# Altium schematic sheet Connectors.SchDoc
size A; SheetNumber: 2; SheetTotal: 2
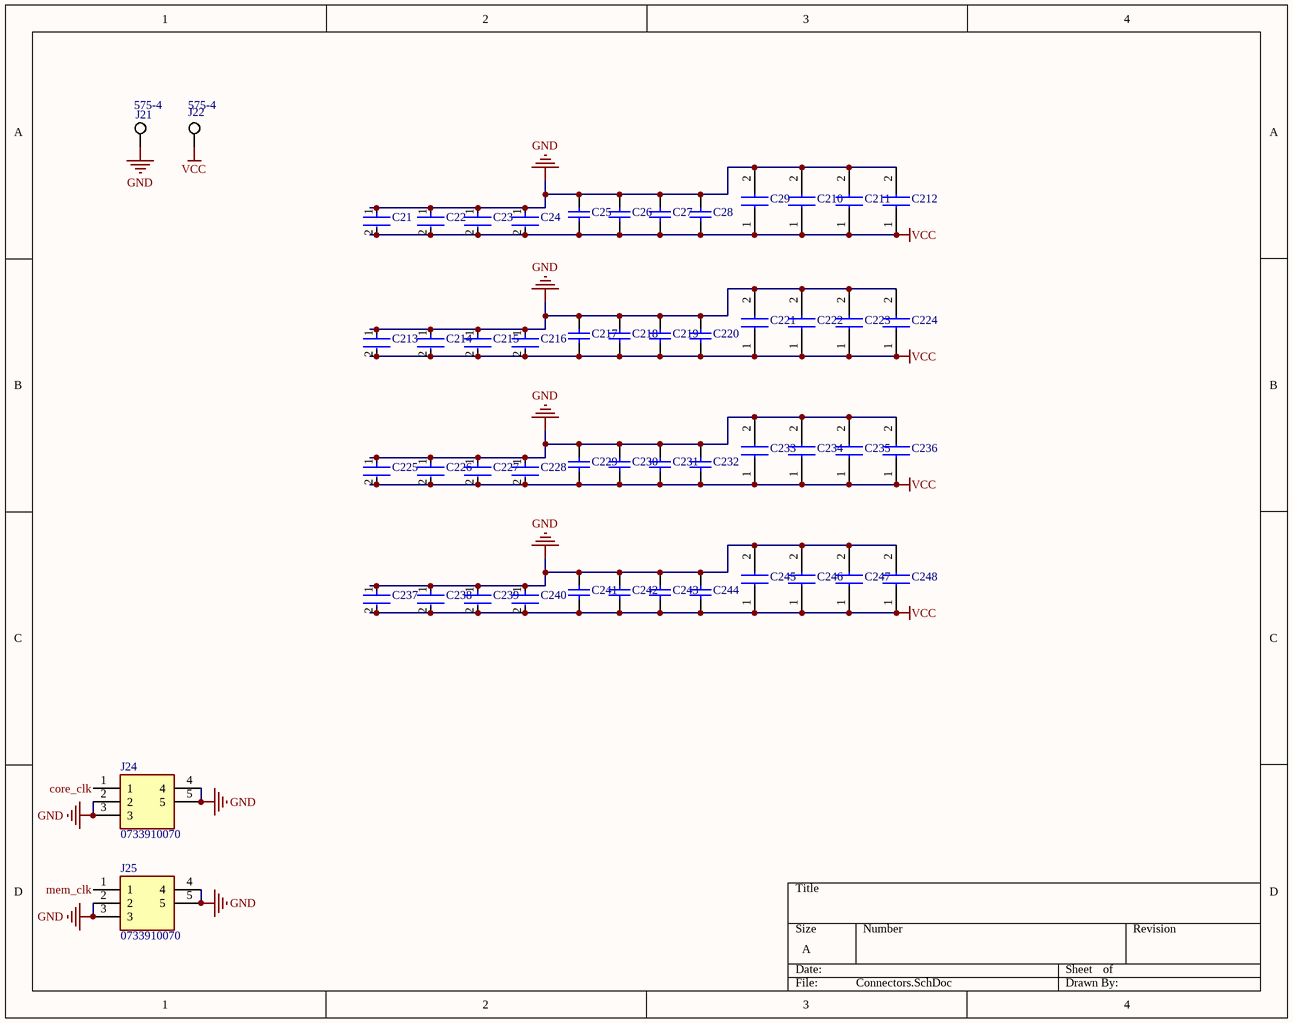
[diagram p0: Connectors.SchDoc]

## Parts
C21  UMK105BJ104KV-F  [FP-0402-L_1_0_0_05-W_0_5-IPC_B]  (value not drawn)
C22  UMK105BJ104KV-F  [FP-0402-L_1_0_0_05-W_0_5-IPC_B]  (value not drawn)
C23  UMK105BJ104KV-F  [FP-0402-L_1_0_0_05-W_0_5-IPC_B]  (value not drawn)
C24  UMK105BJ104KV-F  [FP-0402-L_1_0_0_05-W_0_5-IPC_B]  (value not drawn)
C25  LMK107B7105KA-T  [CAPC1608X90X35NL10T25]  (value not drawn)
C26  LMK107B7105KA-T  [CAPC1608X90X35NL10T25]  (value not drawn)
C27  LMK107B7105KA-T  [CAPC1608X90X35NL10T25]  (value not drawn)
C28  LMK107B7105KA-T  [CAPC1608X90X35NL10T25]  (value not drawn)
C29  KGM15CR51A106MT  [CAPC1608X100N]  (value not drawn)
C210  KGM15CR51A106MT  [CAPC1608X100N]  (value not drawn)
C211  KGM15CR51A106MT  [CAPC1608X100N]  (value not drawn)
C212  KGM15CR51A106MT  [CAPC1608X100N]  (value not drawn)
C213  UMK105BJ104KV-F  [FP-0402-L_1_0_0_05-W_0_5-IPC_B]  (value not drawn)
C214  UMK105BJ104KV-F  [FP-0402-L_1_0_0_05-W_0_5-IPC_B]  (value not drawn)
C215  UMK105BJ104KV-F  [FP-0402-L_1_0_0_05-W_0_5-IPC_B]  (value not drawn)
C216  UMK105BJ104KV-F  [FP-0402-L_1_0_0_05-W_0_5-IPC_B]  (value not drawn)
C217  LMK107B7105KA-T  [CAPC1608X90X35NL10T25]  (value not drawn)
C218  LMK107B7105KA-T  [CAPC1608X90X35NL10T25]  (value not drawn)
C219  LMK107B7105KA-T  [CAPC1608X90X35NL10T25]  (value not drawn)
C220  LMK107B7105KA-T  [CAPC1608X90X35NL10T25]  (value not drawn)
C221  KGM15CR51A106MT  [CAPC1608X100N]  (value not drawn)
C222  KGM15CR51A106MT  [CAPC1608X100N]  (value not drawn)
C223  KGM15CR51A106MT  [CAPC1608X100N]  (value not drawn)
C224  KGM15CR51A106MT  [CAPC1608X100N]  (value not drawn)
C225  UMK105BJ104KV-F  [FP-0402-L_1_0_0_05-W_0_5-IPC_B]  (value not drawn)
C226  UMK105BJ104KV-F  [FP-0402-L_1_0_0_05-W_0_5-IPC_B]  (value not drawn)
C227  UMK105BJ104KV-F  [FP-0402-L_1_0_0_05-W_0_5-IPC_B]  (value not drawn)
C228  UMK105BJ104KV-F  [FP-0402-L_1_0_0_05-W_0_5-IPC_B]  (value not drawn)
C229  LMK107B7105KA-T  [CAPC1608X90X35NL10T25]  (value not drawn)
C230  LMK107B7105KA-T  [CAPC1608X90X35NL10T25]  (value not drawn)
C231  LMK107B7105KA-T  [CAPC1608X90X35NL10T25]  (value not drawn)
C232  LMK107B7105KA-T  [CAPC1608X90X35NL10T25]  (value not drawn)
C233  KGM15CR51A106MT  [CAPC1608X100N]  (value not drawn)
C234  KGM15CR51A106MT  [CAPC1608X100N]  (value not drawn)
C235  KGM15CR51A106MT  [CAPC1608X100N]  (value not drawn)
C236  KGM15CR51A106MT  [CAPC1608X100N]  (value not drawn)
C237  UMK105BJ104KV-F  [FP-0402-L_1_0_0_05-W_0_5-IPC_B]  (value not drawn)
C238  UMK105BJ104KV-F  [FP-0402-L_1_0_0_05-W_0_5-IPC_B]  (value not drawn)
C239  UMK105BJ104KV-F  [FP-0402-L_1_0_0_05-W_0_5-IPC_B]  (value not drawn)
C240  UMK105BJ104KV-F  [FP-0402-L_1_0_0_05-W_0_5-IPC_B]  (value not drawn)
C241  LMK107B7105KA-T  [CAPC1608X90X35NL10T25]  (value not drawn)
C242  LMK107B7105KA-T  [CAPC1608X90X35NL10T25]  (value not drawn)
C243  LMK107B7105KA-T  [CAPC1608X90X35NL10T25]  (value not drawn)
C244  LMK107B7105KA-T  [CAPC1608X90X35NL10T25]  (value not drawn)
C245  KGM15CR51A106MT  [CAPC1608X100N]  (value not drawn)
C246  KGM15CR51A106MT  [CAPC1608X100N]  (value not drawn)
C247  KGM15CR51A106MT  [CAPC1608X100N]  (value not drawn)
C248  KGM15CR51A106MT  [CAPC1608X100N]  (value not drawn)
J21  575-4  [KSTN-575-4]
J22  575-4  [KSTN-575-4]
J24  0733910070  [0733910070]
J25  0733910070  [0733910070]

## Nets
GND: C21.1 C22.1 C23.1 C24.1 C25.2 C26.2 C27.2 C28.2 C29.2 C210.2 C211.2 C212.2 C213.1 C214.1 C215.1 C216.1 C217.2 C218.2 C219.2 C220.2 C221.2 C222.2 C223.2 C224.2 C225.1 C226.1 C227.1 C228.1 C229.2 C230.2 C231.2 C232.2 C233.2 C234.2 C235.2 C236.2 C237.1 C238.1 C239.1 C240.1 C241.2 C242.2 C243.2 C244.2 C245.2 C246.2 C247.2 C248.2 J21.1 J24.2 J24.3 J24.4 J24.5 J25.2 J25.3 J25.4 J25.5
VCC: C21.2 C22.2 C23.2 C24.2 C25.1 C26.1 C27.1 C28.1 C29.1 C210.1 C211.1 C212.1 C213.2 C214.2 C215.2 C216.2 C217.1 C218.1 C219.1 C220.1 C221.1 C222.1 C223.1 C224.1 C225.2 C226.2 C227.2 C228.2 C229.1 C230.1 C231.1 C232.1 C233.1 C234.1 C235.1 C236.1 C237.2 C238.2 C239.2 C240.2 C241.1 C242.1 C243.1 C244.1 C245.1 C246.1 C247.1 C248.1 J22.1
core_clk: J24.1
mem_clk: J25.1

## Library data of the parts
C21-C24 C213-C216 C225-C228 C237-C240 = CMP-14477-000330-2: None; Voltage Rating (DC): 50V; Capacitance: 100nF; Dielectric: X5R; Tolerance: 10%; RoHS Compliant: Yes; Termination: SMD/SMT; Packaging: Tape and Reel; Height: 0.5mm; Halogen Free: Halogen Free; Case Code (Metric): 1005; Width: 0.02inch; Max Operating Temperature: 85°C; Voltage Rating: 50V; Min Operating Temperature: -55°C; Package Quantity: 10000; Case/Package: 0402; Case Code (Imperial): 0402; Length: 0.039inch; Thickness: 0.022inch; Mount: Surface Mount
C25-C28 C217-C220 C229-C232 C241-C244 = CMP-2000-05445-2: None; Dielectric: X7R; Tolerance: 10%; Voltage Rating: 10V; Capacitance: 1uF; Halogen Free: Halogen Free; Construction: Flat; Max Operating Temperature: 125°C; Packaging: Tape and Reel; REACH SVHC: No SVHC; Width: 0.031inch; Case/Package: 0603; Number of Pins: 2; Resistor Type: Ceramic; Case Code (Imperial): 0603; Termination: SMD/SMT; RoHS Compliant: Yes; Depth: 0.8mm; Height: 0.8mm; Mount: Surface Mount; Case Code (Metric): 1608; Voltage Rating (DC): 10V; Series: M; Length: 1.6mm; Radiation Hardening: No; Lead Free: Lead Free; Min Operating Temperature: -55°C; Thickness: 0.035inch; Package Quantity: 1
C29 C210-C212 C221-C224 C233-C236 C245-C248 = KGM15CR51A106MT: Capacitor; Manufacturer_Name: AVX; Datasheet Link: https://4donline.ihs.com/images/VipMasterIC/IC/AVXC/AVXC-S-A0018162488/AVXC-S-A0018400965-1.pdf?hkey=EF798316E3902B6ED9A73243A3159BB0; Height: 1mm; Manufacturer_Part_Number: KGM15CR51A106MT
J21 J22 = CMP-2000-05649-1: Banana Jack, Non-Insulated, 1-Pin THD, RoHS, Bulk; Manufacturer: Keystone-Electronics; Package Version: Rev. B, 11/1994; Plug/Mating Plug Diameter: StandardBanana; Gender: Female; Package Reference: 575-4; Operating Temperature: -; Contact Material: Brass; Packaging: Bulk; Series: -; Category: Connectors,Interconnects; Color: -; Type: BananaJack; Contact Finish: Nickel; Features: -; Family: BananaandTipConnectors-Jacks,Plugs; Body Material: -; Manufacturer URL: http://www.keyelco.com/; Termination: Solder; Insulation: Non-Insulated; Datasheet Version: Rev. B, 11/1994; Mounting Technology: ThroughHole; Package URL: http://www.keyelco.com/product-pdf.cfm?p=2379; Mounting Type: ThroughHole; Package Description: 1-Pin Through Hole Device, Dia 7.92 mm; Datasheet URL: http://www.keyelco.com/product-pdf.cfm?p=2379; Wire Gauge: -
J24 J25 = 0733910070: Connector; Manufacturer_Name: Molex; Datasheet Link: https://www.molex.com/pdm_docs/sd/733910070_sd.pdf; Height: 10mm; Manufacturer_Part_Number: 0733910070; Mouser Part Number: N/A; Mouser Price/Stock: https://www.mouser.co.uk/ProductDetail/Molex/0733910070?qs=PBcRNPEHKsq1tOlFMTxPGQ%3D%3D; Arrow Part Number: 0733910070; Arrow Price/Stock: https://www.arrow.com/en/products/0733910070/molex